# EAGLE design TALON_SRX v1.4 (EAGLE 8.4.2)
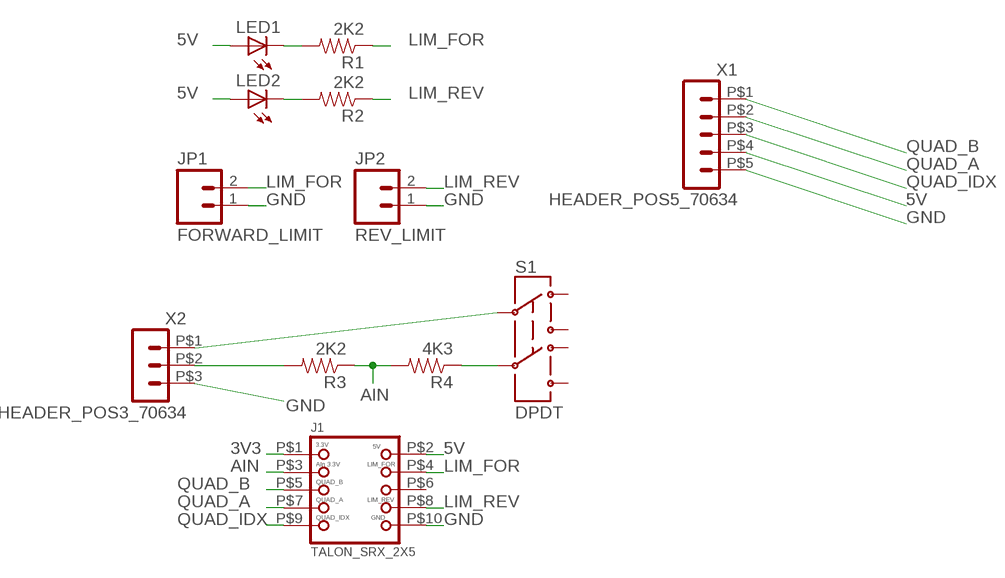
[diagram p0: schematic, sheet 1]

## Parts
J1  TALON_SRX_2X5  [2X5-0.05-HEADER]
JP1  FORWARD_LIMIT  M02POLAR  [MOLEX-1X2]
JP2  REV_LIMIT  M02POLAR  [MOLEX-1X2]
LED1  LEDCHIP-LED0805  [CHIP-LED0805]
LED2  LEDCHIP-LED0805  [CHIP-LED0805]
R1  2K2  RESISTOR0805-RES  [0805]
R2  2K2  RESISTOR0805-RES  [0805]
R3  2K2  RESISTOR0805-RES  [0805]
R4  4K3  RESISTOR0805-RES  [0805]
S1  DPDT  SWITCH-DPDTAYZ0202  [AYZ0202]
X1  HEADER_POS5_70634  [70634-POS5]
X2  HEADER_POS3_70634  [70634-POS3]

## Nets
3V3: J1.P$1
5V: J1.P$2 LED1.A LED2.A X1.P$4
AIN: J1.P$3 R3.1 R4.2
GND: J1.P$10 JP1.1 JP2.1 X1.P$5 X2.P$3
LIM_FOR: J1.P$4 JP1.2 R1.1
LIM_REV: J1.P$8 JP2.2 R2.1
N$1: LED2.C R2.2
N$2: LED1.C R1.2
N$4: R3.2 X2.P$2
N$6: R4.1 S1.5
N$7: S1.2 X2.P$1
QUAD_A: J1.P$7 X1.P$2
QUAD_B: J1.P$5 X1.P$1
QUAD_IDX: J1.P$9 X1.P$3
Unconnected: J1.P$6 S1.1 S1.3 S1.4 S1.6

## Library data of the parts
J1 = Peter:TALON_SRX_2X5
JP1 JP2 = SparkFun-Connectors:M02: Standard 2-pin 0.1" header. Use with - straight break away headers ( PRT-00116) - right angle break away headers (PRT-00553) - swiss pins (PRT-00743) - machine pins (PRT-00117) - female headers (PRT-00115) Molex polarized connector foot print use with: PRT-08233 with associated crimp pins and housings. 2.54_SCREWTERM for use with PRT-10571. 3.5mm Screw Terminal footprints for PRT-08084 5mm Screw Terminal footprints for use with PRT-08433
LED1 LED2 = adafruit:LED: LED OSRAM: - CHIPLED LG R971, LG N971, LY N971, LG Q971, LY Q971, LO R971, LY R971 LH N974, LH R974 LS Q976, LO Q976, LY Q976 LO Q996 - Hyper CHIPLED LW Q18S LB Q993, LB Q99A, LB R99A - SideLED LS A670, LO A670, LY A670, LG A670, LP A670 LB A673, LV A673, LT A673, LW A673 LH A674 LY A675 LS A676, LA A676, LO A676, LY A676, LW A676 LS A679, LY A679, LG A679 - Hyper Micro SIDELED® LS Y876, LA Y876, LO Y876, LY Y876 LT Y87S - SmartLED LW L88C, LW L88S LB L89C, LB L89S, LG L890 LS L89K, LO L89K, LY L89K LS L896, LA L896, LO L896, LY L896 - TOPLED LS T670, LO T670, LY T670, LG T670, LP T670 LSG T670, LSP T670, LSY T670, LOP T670, LYG T670 LG T671, LOG T671, LSG T671 LB T673, LV T673, LT T673, LW T673 LH T674 LS T676, LA T676, LO T676, LY T676, LB T676, LH T676, LSB T676, LW T676 LB T67C, LV T67C, LT T67C, LS T67K, LO T67K, LY T67K, LW E67C LS E67B, LA E67B, LO E67B, LY E67B, LB E67C, LV E67C, LT E67C LW T67C LS T679, LY T679, LG T679 LS T770, LO T770, LY T770, LG T770, LP T770 LB T773, LV T773, LT T773, LW T773 LH T774 LS E675, LA E675, LY E675, LS T675 LS T776, LA T776, LO T776, LY T776, LB T776 LHGB T686 LT T68C, LB T68C - Hyper Mini TOPLED® LB M676 - Mini TOPLED Santana® LG M470 LS M47K, LO M47K, LY M47K Source: http://www.osram.convergy.de/
R1-R4 = SparkFun-Passives:RESISTOR: Resistor Basic schematic elements and footprints for 0603, 1206, and PTH resistors.
S1 = SparkFun-Electromechanical:SWITCH-DPDT: DPDT Version of the COM-00597; PROD_ID: SWCH-08179
X1 = con-molex-c-grid-sl:HEADER_POS5_?: Molex -C-Grid® / SL Series connector Wire-to-Board 2.54 mm (0.100") pitch header, 5 positions.
X2 = con-molex-c-grid-sl:HEADER_POS3_?: Molex -C-Grid® / SL Series connector Wire-to-Board 2.54 mm (0.100") pitch header, 3 positions.

## Board
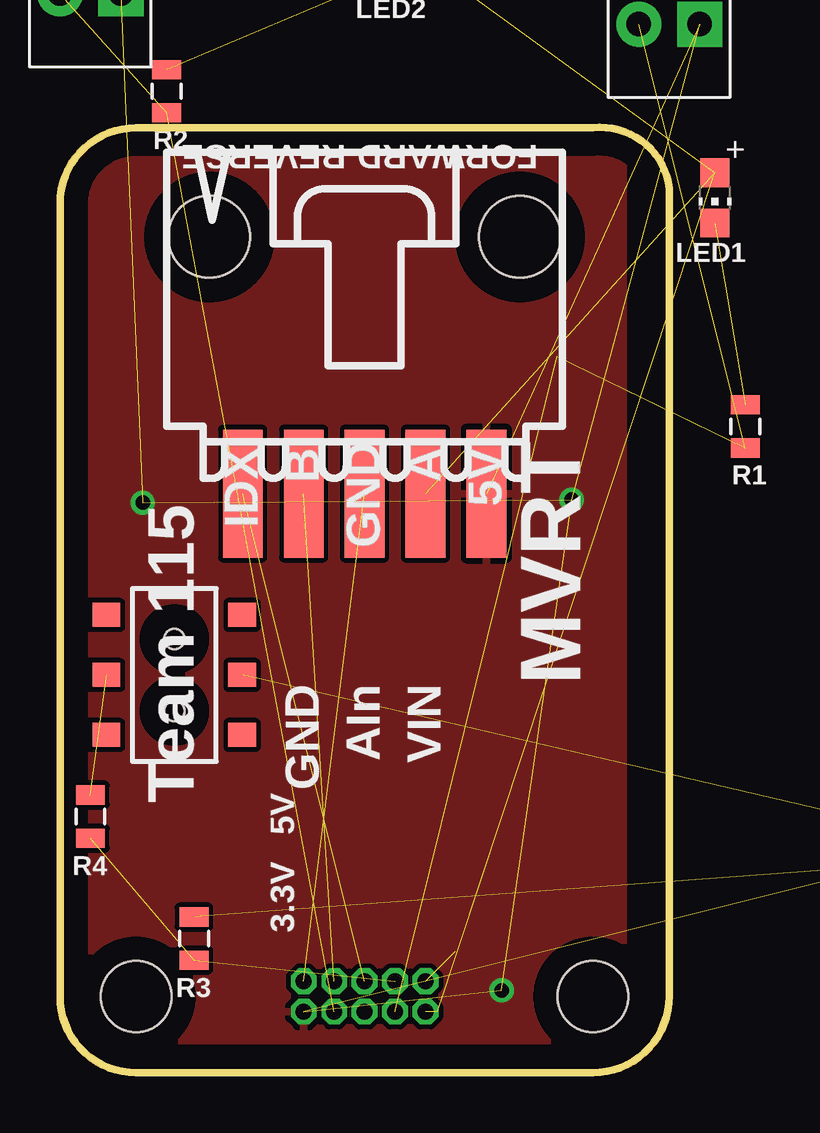
[diagram p1: board, top side]
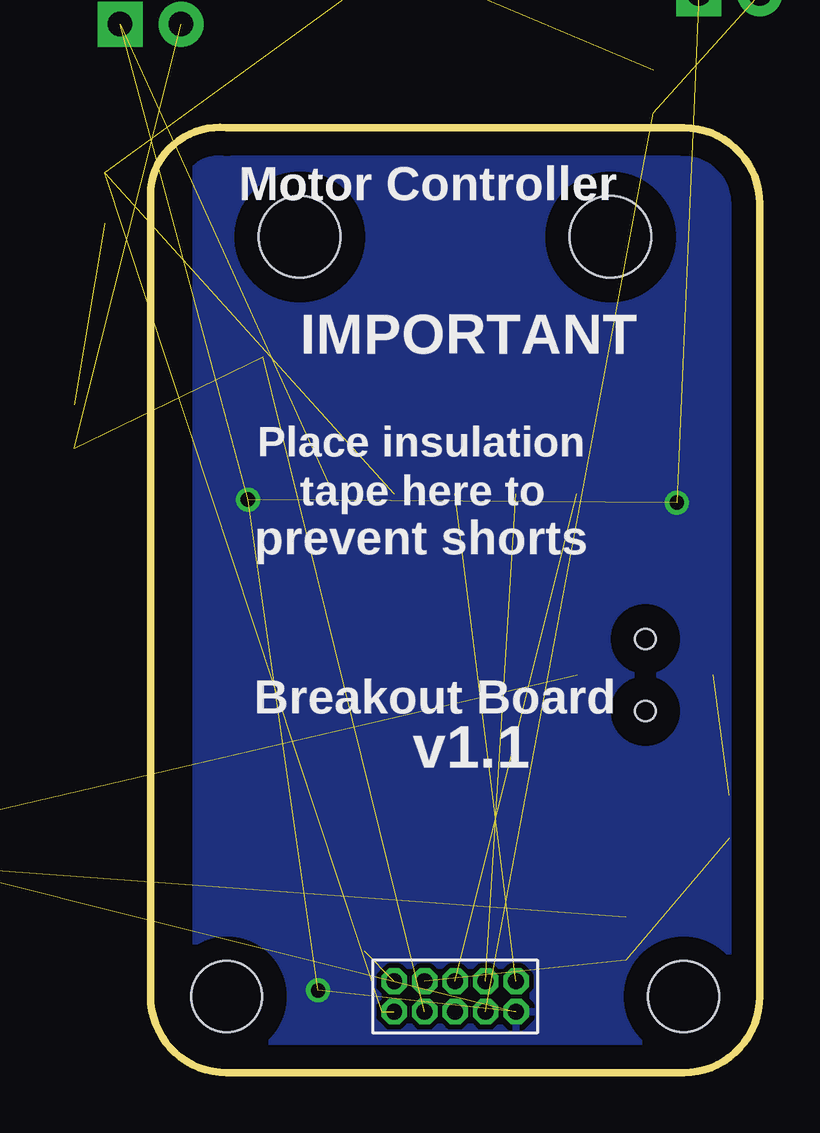
[diagram p2: board, bottom side, seen from below]

Size 25.4 x 39.39 mm. Coordinates in mm from the lower left corner, seen from the top.
Outline: 3.17,39.37 22.23,39.37 arc-90 25.4,36.83 25.4,3.17 arc-90 22.23,0 3.17,0 arc-90 0,3.17 0,36.2 arc-90 3.17,39.37
Copper layers (1*16): Top 0.035mm / dielectric 1.5mm / Bottom 0.035mm
Design rules "default *": minimum track width 10mil, minimum drill 20mil, track to track 8mil, track to pad 8mil, pad to pad 8mil, via to via 8mil, smd to smd 8mil, copper to edge 40mil, drill to drill 8mil, minimum pad ring 8mil, minimum via ring 8mil, stop-mask expansion 4mil, vias tented up to drill 24mil, thermal gap 10mil
Holes 2.95 mm at 3.17,3.17 22.23,3.17

### Footprints (pad centres in the part's own frame; a part is rotated, then mirrored left to right if it is on the bottom)
2X5-0.05-HEADER = drill 0.66 octagon: P$1 2.54,-0.635; P$2 2.54,0.635; P$3 1.27,-0.635; P$4 1.27,0.635; P$5 0,-0.635; P$6 0,0.635; P$7 -1.27,-0.635; P$8 -1.27,0.635; P$9 -2.54,-0.635; P$10 -2.54,0.635
MOLEX-1X2 = drill 1.016 pad 1.88 square: 1 0,0 | drill 1.016 pad 1.88: 2 2.54,0
CHIP-LED0805 = smd 1.2 x 1.2: A 0,-1.05; C 0,1.05
0805 = smd 0.8 x 1.2: 1 -0.9,0; 2 0.9,0
AYZ0202 = smd 1 x 1.15: 1 -2.5,2.825; 2 0,2.825; 3 2.5,2.825; 4 -2.5,-2.825; 5 0,-2.825; 6 2.5,-2.825 | hole 0.85: 1.5,0; -1.5,0
70634-POS5 = smd 1.651 x 5.334: P$1 -5.08,0; P$2 -2.54,0; P$3 0,0; P$4 2.54,0; P$5 5.08,0 | hole 3.404: -6.477,10.693; 6.477,10.693
70634-POS3 = smd 1.651 x 5.334: P$1 -2.54,0; P$2 0,0; P$3 2.54,0 | hole 3.404: -3.937,10.693; 3.937,10.693

### Placement (x,y rotation side)
J1  12.7,3.17 180 bottom
JP1  26.67,43.69 180 top  (outside the outline)
JP2  2.54,44.96 180 top  (outside the outline)
LED1  27.3,36.45 180 top
LED2  13.34,46.61 180 top  (outside the outline)
R1  28.57,26.92 90 top  (outside the outline)
R2  4.45,40.89 90 top
R3  5.59,5.59 90 top
R4  1.27,10.67 270 top
S1  4.77,16.57 270 top
X1  12.7,24.13 0 top
X2  38.1,8.89 180 top  (outside the outline)

### Tracks (layer width: path | path; a pad name or v marks a point on that pad's centre or on a via)
3V3  (1 unrouted)
5V  (4 unrouted)
AIN  (2 unrouted)
GND  (via drill 0.6)  (7 unrouted)
  other vias: 3.45,23.75 18.41,3.43 21.34,23.88
  pour Bottom: -1.91,41.91 23.5,41.91 23.5,-1.91 -1.91,-1.91
  pour Top: -1.91,41.91 -1.91,-1.91 23.5,-1.91 23.5,41.91
LIM_FOR  (3 unrouted)
LIM_REV  (2 unrouted)
N$1  (1 unrouted)
N$2  (1 unrouted)
N$4  (1 unrouted)
N$6  (1 unrouted)
N$7  (1 unrouted)
QUAD_A  (1 unrouted)
QUAD_B  (1 unrouted)
QUAD_IDX  (1 unrouted)

### Text on the board
tNames: REVERSE | FORWARD | IDX | B | GND | A | 5V | GND | AIn | VIN | MVRT | Team 115 | 5V | 3.3V
bNames: Motor Controller | IMPORTANT | Place insulation | tape here to | prevent shorts | Breakout Board | v1.1